# Altium schematic sheet Sheet1.SchDoc
size A3; SheetNumber: 1; SheetTotal: 1
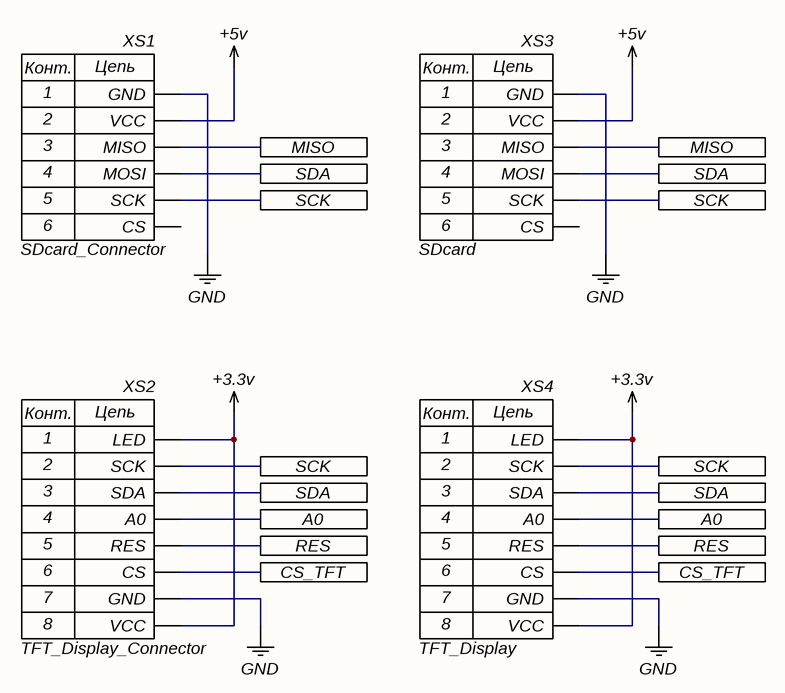
[diagram p0: Sheet1.SchDoc]

## Parts
XS1  SDcard_Connector  [PinOutX6]
XS2  TFT_Display_Connector  [PinOutX8]
XS3  SDcard  [SDcard]
XS4  TFT_Display  [TFT]

## Ports
A0 (see Sheet1[4C]), A0 (see Sheet1[5C]), CS_TFT (see Sheet1[4C]), CS_TFT (see Sheet1[5C]), MISO (see Sheet1[4B]), MISO (see Sheet1[5B]), RES (see Sheet1[4C]), RES (see Sheet1[5C]), SCK (see Sheet1[4B], Sheet1[5B]), SDA (see Sheet1[4B], Sheet1[4C], Sheet1[5B]), SDA (see Sheet1[4B], Sheet1[4C], Sheet1[5C]), SDA (see Sheet1[4B], Sheet1[5B], Sheet1[5C]), SDA (see Sheet1[4C], Sheet1[5B], Sheet1[5C])

## Nets
+3.3v: XS2.1(LED) XS2.8(VCC) XS4.1(LED) XS4.8(VCC)
+5v: XS1.2(VCC) XS3.2(VCC)
GND: XS1.1(GND) XS2.7(GND) XS3.1(GND) XS4.7(GND)
A0: XS2.4(A0) XS4.4(A0) ; port A0
CS_TFT: XS2.6(CS) XS4.6(CS) ; port CS_TFT
MISO: XS1.3(MISO) XS3.3(MISO) ; port MISO
RES: XS2.5(RES) XS4.5(RES) ; port RES
SCK: XS1.5(SCK) XS2.2(SCK) XS3.5(SCK) XS4.2(SCK) ; port SCK
SDA: XS1.4(MOSI) XS2.3(SDA) XS3.4(MOSI) XS4.3(SDA) ; port SDA

Not connected (* = marked no-connect by the designer): XS1 6(CS); XS3 6(CS)

## Notes on the sheet
- (in symbol SDcard) Конт.; Цепь
- (in symbol SDcard_Connector) Конт.; Цепь
- (in symbol TFT_Display) Цепь; Конт.
- (in symbol TFT_Display_Connector) Цепь; Конт.